# EAGLE design v1 (EAGLE 8.5.1)
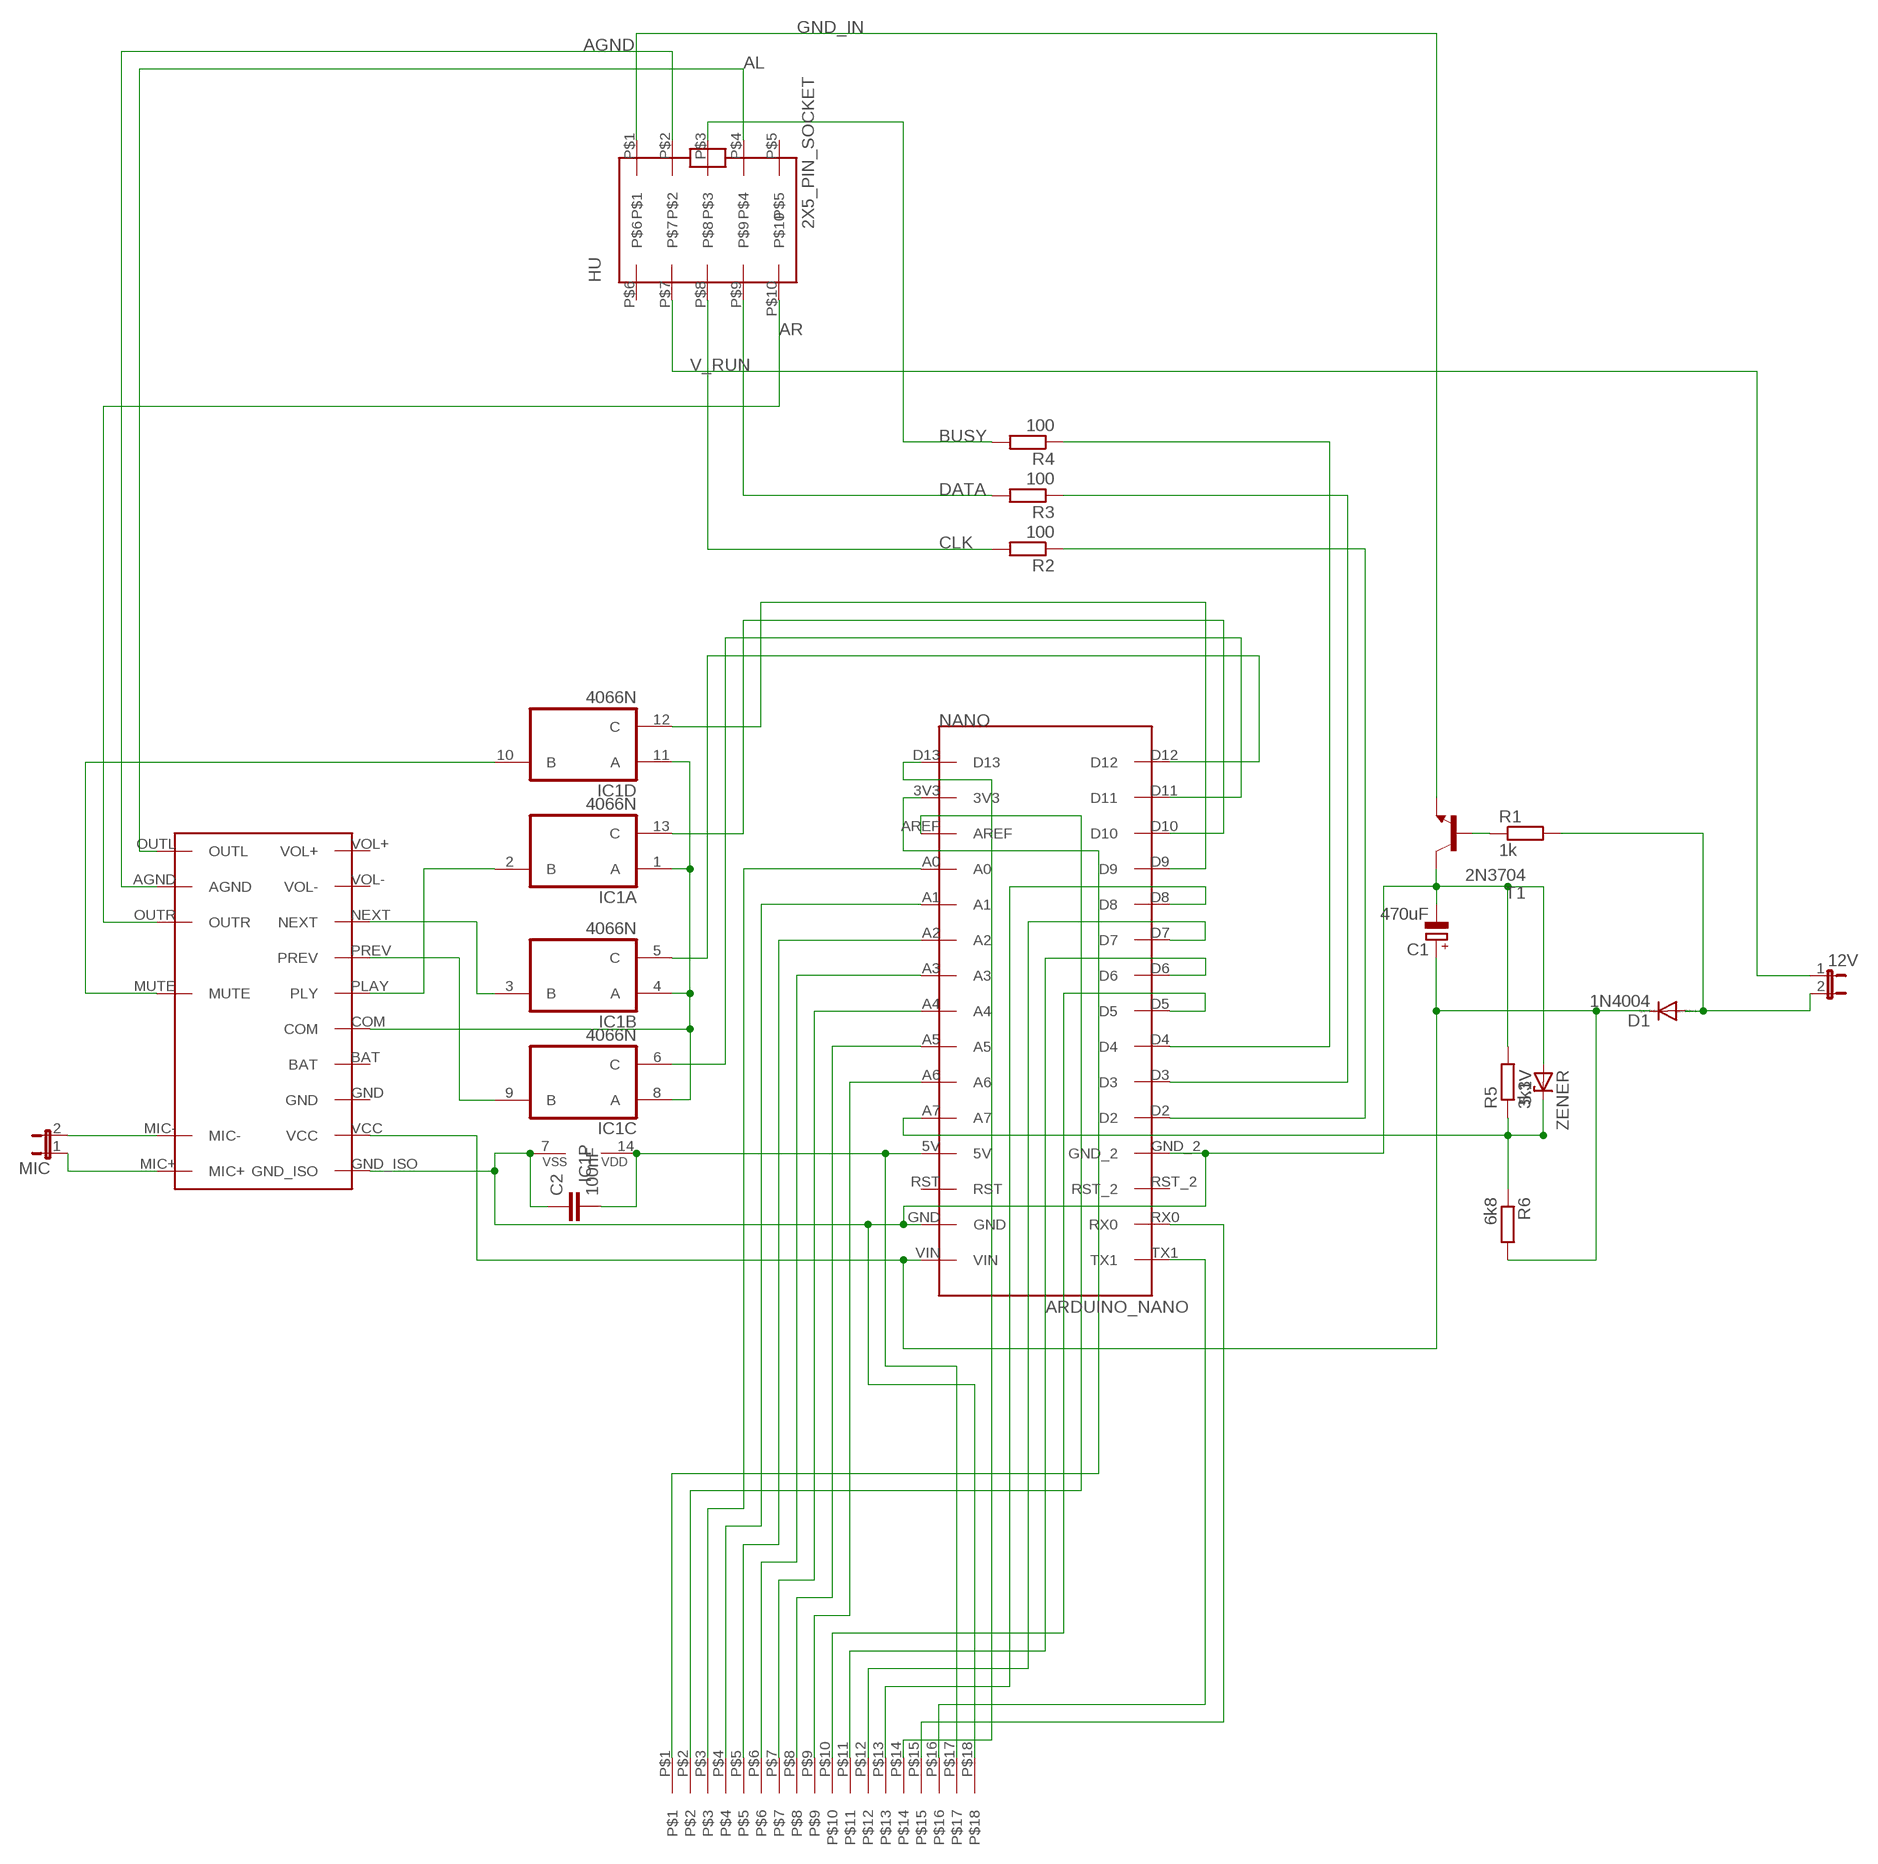
[diagram p0: schematic, sheet 1]

## Parts
12V  JP1E  [JP1]
C1  470uF  CPOL-EUE3.5-8  [E3,5-8]
C2  100nF  C-EUC1206  [C1206]
D1  1N4004  [DO41-10]
HU  2X5_PIN_SOCKET  [2X5_PIN_SOCKET]
IC1  4066N  [DIL14]
MIC  JP1E  [JP1]
NANO  ARDUINO_NANO  [ARDUINO_NANO]
R1  1k  R-EU_0207/10  [0207/10]
R2  100  R-EU_0207/10  [0207/10]
R3  100  R-EU_0207/10  [0207/10]
R4  100  R-EU_0207/10  [0207/10]
R5  3k3  R-EU_0207/10  [0207/10]
R6  6k8  R-EU_0207/10  [0207/10]
T1  2N3704  [TO92]
U$1  JMP18X1  [JMP18X1]
U$2  CSR8645_MODULE  [CSR8645_MODULE]
ZENER  5.1V  ZENER-DIODEDO41Z10  [DO41Z10]

## Nets
12V: 12V.2 D1.A R1.2
AGND: HU.P$2 U$2.AGND
AL: HU.P$4 U$2.OUTL
AR: HU.P$10 U$2.OUTR
BUSY: HU.P$3 R4.2
CLK: HU.P$8 R2.2
DATA: HU.P$9 R3.2
GND: C1.- C2.1 IC1.7(P:VSS) NANO.GND NANO.GND_2 R5.2 T1.2(C) U$1.P$18 U$2.GND_ISO ZENER.A
GND_IN: HU.P$1 T1.3(E)
N$1: IC1.5(B:C) NANO.D12
N$2: IC1.6(C:C) NANO.D11
N$3: IC1.13(A:C) NANO.D10
N$4: IC1.12(D:C) NANO.D9
N$5: NANO.TX1 U$1.P$16
N$6: IC1.1(A:A) IC1.4(B:A) IC1.8(C:A) IC1.11(D:A) U$2.COM
N$7: R1.1 T1.1(B)
N$8: NANO.A7 R5.1 R6.1 ZENER.C
N$9: IC1.2(A:B) U$2.PLAY(PLY)
N$10: NANO.RX0 U$1.P$15
N$11: IC1.9(C:B) U$2.PREV
N$12: IC1.3(B:B) U$2.NEXT
N$13: NANO.D2 R2.1
N$14: C2.2 IC1.14(P:VDD) NANO.5V U$1.P$17
N$15: IC1.10(D:B) U$2.MUTE
N$16: NANO.D3 R3.1
N$17: NANO.D4 R4.1
N$18: NANO.D13 U$1.P$14
N$19: NANO.D8 U$1.P$13
N$20: NANO.D7 U$1.P$12
N$21: NANO.D6 U$1.P$11
N$22: NANO.D5 U$1.P$10
N$23: NANO.A6 U$1.P$9
N$24: NANO.A5 U$1.P$8
N$25: NANO.A4 U$1.P$7
N$26: NANO.A3 U$1.P$6
N$27: NANO.A2 U$1.P$5
N$28: NANO.A1 U$1.P$4
N$29: NANO.A0 U$1.P$3
N$30: NANO.AREF U$1.P$2
N$31: NANO.3V3 U$1.P$1
N$32: MIC.1 U$2.MIC+
N$33: MIC.2 U$2.MIC-
V_RUN: 12V.1 HU.P$7
VCC: C1.+ D1.C NANO.VIN R6.2 U$2.VCC
Unconnected: HU.P$5 HU.P$6 NANO.RST NANO.RST_2 U$2.BAT U$2.GND U$2.VOL+ U$2.VOL-

## Library data of the parts
12V MIC = jumper:JP1E: JUMPER
C1 = rcl:CPOL-EU: POLARIZED CAPACITOR, European symbol; SPICEPREFIX: C
C2 = rcl:C-EU: CAPACITOR, European symbol; SPICEPREFIX: C
D1 = diode:1N4004: DIODE general purpose rectifier, 1 A
HU = archi_laptop:2X5_PIN_SOCKET
IC1 = 40xx:4066: Quad bilateral ANALOG SWITCH
NANO = archi_laptop:ARDUINO_NANO
R1-R6 = rcl:R-EU_: RESISTOR, European symbol; SPICEPREFIX: R
T1 = transistor:2N3704: NPN TRANSISTOR
U$1 = archi_laptop:JMP18X1
U$2 = archi_laptop:CSR8645_MODULE
ZENER = diode:ZENER-DIODE: Z-Diode

## Board
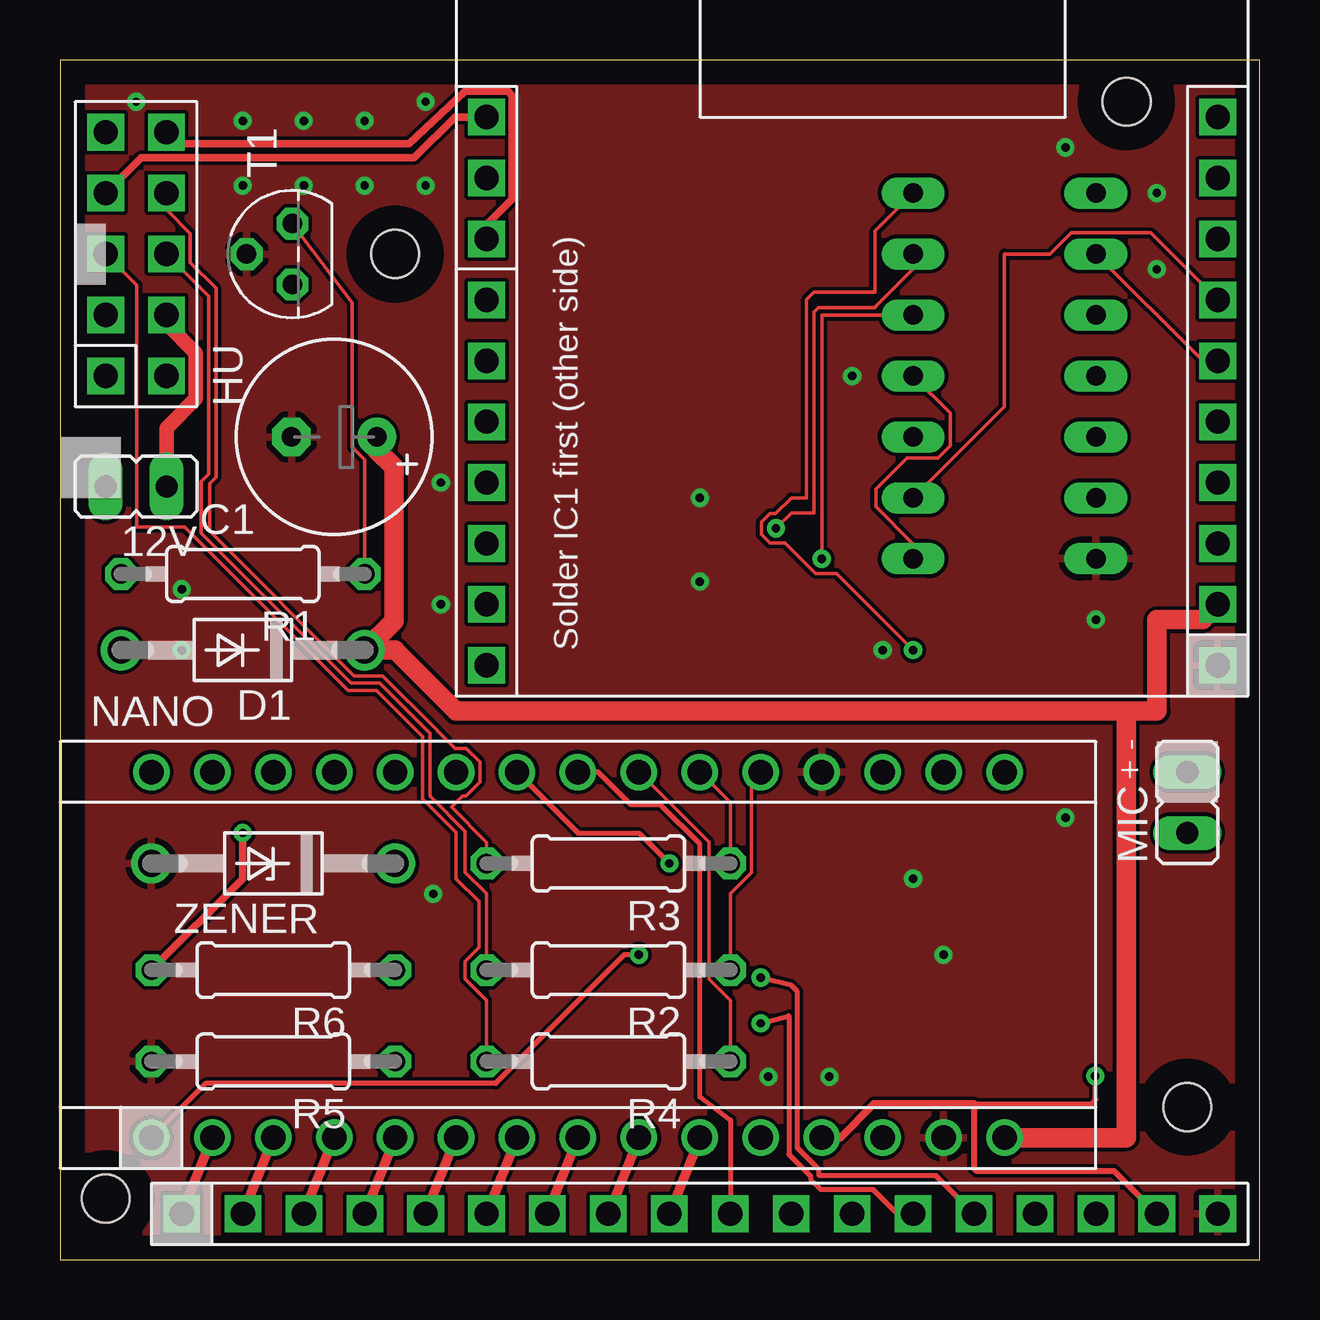
[diagram p1: board, top side]
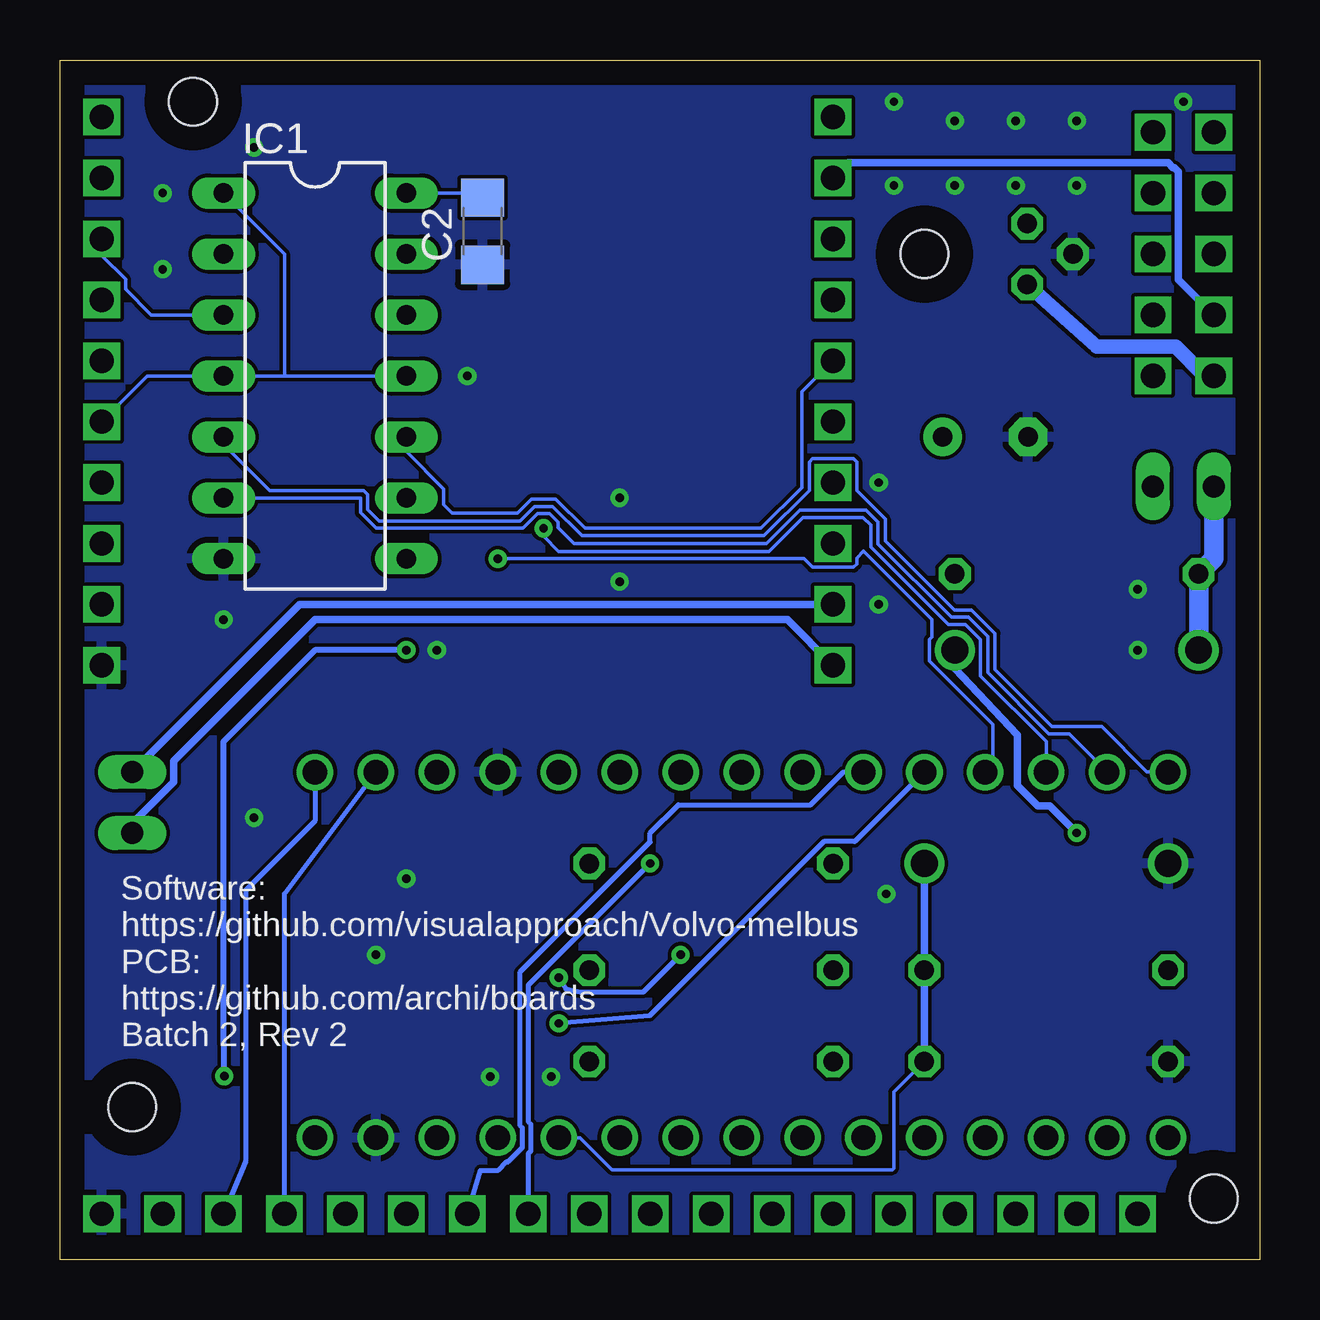
[diagram p2: board, bottom side, seen from below]

Size 50 x 50 mm. Coordinates in mm from the lower left corner, seen from the top.
Outline: 0,0 50,0 50,50 0,50 0,0
Copper layers (1*16): Top 0.035mm / dielectric 1.5mm / Bottom 0.035mm
Design rules "default *": minimum track width 6mil, minimum drill 0.35mm, track to track 6mil, track to pad 6mil, pad to pad 6mil, via to via 6mil, smd to smd 6mil, copper to edge 40mil, drill to drill 6mil, minimum pad ring 10mil, minimum via ring 8mil, stop-mask expansion 4mil, vias tented up to drill 0mil, thermal gap 10mil
Holes 2 mm at 13.97,41.91 46.99,6.35 44.45,48.26 1.91,2.54

### Footprints (pad centres in the part's own frame; a part is rotated, then mirrored left to right if it is on the bottom)
JP1 = drill 0.914 long: 1 0,-1.27; 2 0,1.27
E3,5-8 = drill 0.813 pad 1.6: + -1.778,0 | drill 0.813 pad 1.6 octagon: - 1.778,0
C1206 = smd 1.6 x 1.8: 1 -1.4,0; 2 1.4,0
DO41-10 = drill 1.118: A 5.08,0; C -5.08,0
2X5_PIN_SOCKET = drill 1.016 square: P$1 -5.08,2.54; P$2 -2.54,2.54; P$3 0,2.54; P$4 2.54,2.54; P$5 5.08,2.54; P$6 -5.08,0; P$7 -2.54,0; P$8 0,0; P$9 2.54,0; P$10 5.08,0
DIL14 = drill 0.813 long: 1 -7.62,-3.81; 2 -5.08,-3.81; 3 -2.54,-3.81; 4 0,-3.81; 5 2.54,-3.81; 6 5.08,-3.81; 7 7.62,-3.81; 8 7.62,3.81; 9 5.08,3.81; 10 2.54,3.81; 11 0,3.81; 12 -2.54,3.81; 13 -5.08,3.81; 14 -7.62,3.81
ARDUINO_NANO = drill 1.016: 3V3 -7.62,12.7; 5V -7.62,-12.7; A0 -7.62,7.62; A1 -7.62,5.08; A2 -7.62,2.54; A3 -7.62,0; A4 -7.62,-2.54; A5 -7.62,-5.08; A6 -7.62,-7.62; A7 -7.62,-10.16; AREF -7.62,10.16; D2 7.62,-10.16; D3 7.62,-7.62; D4 7.62,-5.08; D5 7.62,-2.54; D6 7.62,0; D7 7.62,2.54; D8 7.62,5.08; D9 7.62,7.62; D10 7.62,10.16; D11 7.62,12.7; D12 7.62,15.24; D13 -7.62,15.24; GND -7.62,-17.78; GND_2 7.62,-12.7; RST -7.62,-15.24; RST_2 7.62,-15.24; RX0 7.62,-17.78; TX1 7.62,-20.32; VIN -7.62,-20.32
0207/10 = drill 0.813 octagon: 1 -5.08,0; 2 5.08,0
TO92 = drill 0.813 octagon: 1 1.27,0; 2 0,1.905; 3 -1.27,0
JMP18X1 = drill 1.016 square: P$1 0,12.7; P$2 0,10.16; P$3 0,7.62; P$4 0,5.08; P$5 0,2.54; P$6 0,0; P$7 0,-2.54; P$8 0,-5.08; P$9 0,-7.62; P$10 0,-10.16; P$11 0,-12.7; P$12 0,-15.24; P$13 0,-17.78; P$14 0,-20.32; P$15 0,-22.86; P$16 0,-25.4; P$17 0,-27.94; P$18 0,-30.48
CSR8645_MODULE = drill 1.016 square: AGND -15.24,5.08; BAT 15.24,-7.62; COM 15.24,-5.08; GND 15.24,-10.16; GND_ISO 15.24,-15.24; MIC+ -15.24,-15.24; MIC- -15.24,-12.7; MUTE -15.24,-2.54; NEXT 15.24,2.54; OUTL -15.24,7.62; OUTR -15.24,2.54; P$1 -15.24,0; P$2 -15.24,-5.08; P$3 -15.24,-7.62; P$4 -15.24,-10.16; PLAY 15.24,-2.54; PREV 15.24,0; VCC 15.24,-12.7; VOL+ 15.24,7.62; VOL- 15.24,5.08
DO41Z10 = drill 1.118: A 5.08,0; C -5.08,0

### Placement (x,y rotation side)
12V  3.17,32.23 90 top
C1  11.43,34.29 180 top
C2  32.38,42.86 90 bottom
D1  7.62,25.4 180 top
HU  4.45,41.91 90 top
IC1  39.37,36.83 270 bottom
MIC  46.99,19.05 0 top
NANO  19.05,12.7 90 top
R1  7.62,28.57 180 top
R2  22.86,12.06 180 top
R3  22.86,16.51 180 top
R4  22.86,8.26 180 top
R5  8.89,8.26 180 top
R6  8.89,12.06 180 top
T1  9.68,41.91 90 top
U$1  17.78,1.91 90 top
U$2  33.02,40.01 0 top
ZENER  8.89,16.51 180 top

### Tracks (layer width: path | path; a pad name or v marks a point on that pad's centre or on a via)
12V
  Bottom 0.813: 12V.2 1.91,29.21 R1.2 D1.A
AGND
  Bottom 0.305: HU.P$2 3.38,40.84 3.38,45.34 3.56,45.52 3.61,45.52 3.81,45.72 17.14,45.72 U$2.AGND
AL
  Top 0.305: U$2.OUTL 16.47,47.62 14.77,45.92 3.38,45.92 HU.P$4
AR
  Top 0.305: U$2.OUTR 17.78,43.13 18.85,44.2 18.85,48.51 18.67,48.69 16.89,48.69 14.55,46.51 4.92,46.51 HU.P$10
BUSY
  Top 0.152: R4.2 17.78,10.81 16.89,11.7 16.89,12.43 17.46,13.01 17.46,14.92 16.51,15.88 16.51,17.8 15.12,19.19 15.12,21.8 13.2,23.72 12.01,23.72 5.21,30.52 3.2,30.52 3.2,40.62 HU.P$3
CLK
  Top 0.152: R2.2 17.78,15.25 16.89,16.14 16.89,17.85 15.42,19.32 15.42,21.93 13.32,24.03 12.7,24.03 12.13,24.03 5.89,30.27 5.89,32.42 6.2,32.73 6.2,33.02 6.2,40.16 HU.P$8
DATA
  Top 0.152: R3.2 17.78,17.39 16.32,18.86 16.79,19.33 16.92,19.33 17.5,19.91 17.5,20.73 16.92,21.31 16.47,21.31 15.73,22.05 15.72,22.07 13.45,24.33 12.26,24.33 6.23,30.36 | 6.23,30.36 6.19,30.4 | 6.23,30.36 6.23,32.33 6.5,32.61 6.5,40.49 5.44,41.55 5.44,42.77 4.45,43.76 HU.P$9
GND  (via drill 0.35)
  other vias: 7.62,47.47 10.16,47.47 7.62,44.77 10.16,44.77 12.7,44.77 15.24,44.77 12.7,47.47 15.24,48.26 3.17,48.26 15.88,27.3 29.53,7.62 15.56,15.24 32.07,7.62 41.91,46.35 45.72,44.45 41.91,18.41 45.72,41.27 36.83,12.7 35.56,15.88 26.67,28.26 15.88,32.38 33.02,36.83 34.29,25.4 26.67,31.75 43.18,26.67 5.08,25.4 5.08,27.94
  pour Bottom: -2.54,53.34 53.34,52.07 53.34,-15.24 -2.54,-15.24
  pour Top: -2.54,52.7 54.61,52.7 54.61,-2.54 53.34,-3.81 -5.08,-2.54
GND_IN
  Bottom 0.61: HU.P$1 2.27,36.83 3.49,38.05 6.78,38.05 T1.3
N$1
  Bottom 0.152: IC1.5 43.18,33.97 41.26,32.05 37.35,32.05 37.17,31.88 37.17,31.25 36.7,30.79 30.83,30.79 30.22,31.39 29.47,31.39 28.25,30.17 20.65,30.17 18.77,32.05 18.77,33.24 18.64,33.38 16.92,33.38 16.79,33.24 16.79,32.05 15.6,30.86 15.6,29.95 12.72,27.08 12.01,27.08 11.02,26.09 11.02,24.59 8.65,22.21 6.58,22.21 4.69,20.32 NANO.D12
N$2
  Bottom 0.152: IC1.6 37.48,31.75 37.48,31.13 36.83,30.48 30.7,30.48 30.1,31.09 29.59,31.09 29.24,30.73 29.24,30.51 28.57,29.84 20.55,29.84 19.16,31.24 16.41,31.24 15.9,30.73 15.9,29.83 12.84,26.77 12.13,26.77 11.33,25.97 11.33,24.46 8.78,21.91 7.94,21.91 NANO.D11
N$3  (via drill 0.35)
  Top 0.152: v29.84,30.48 30.48,31.11 31.43,31.11 31.43,39.48 31.62,39.67 33.96,39.67 34.01,39.73 34.01,39.74 35.56,41.29 IC1.13
  Bottom 0.152: v29.84,30.48 29.84,30.15 29.21,29.52 20.45,29.52 19.03,30.93 16.53,30.93 16.2,30.61 16.2,29.7 12.97,26.47 12.26,26.47 11.63,25.84 11.63,24.33 8.89,21.59 NANO.D10
N$4  (via drill 0.35)
  Top 0.152: v31.75,29.21 31.75,39.37 IC1.12
  Bottom 0.152: NANO.D9 11.11,20.64 11.11,22.3 13.77,24.96 13.77,25.84 13.65,25.96 13.65,26.67 16.51,29.53 16.79,29.25 16.79,28.99 16.92,28.85 18.64,28.85 18.99,29.21 v31.75,29.21
N$5
  Bottom 0.203: NANO.TX1 39.37,18.28 42.27,15.39 42.27,4.09 U$1.P$16
N$6
  Top 0.152: IC1.8 35.56,29.83 34.01,31.38 34.01,32.12 35.29,33.4 36.59,33.4 37.11,33.92 37.11,35.28 IC1.11
  Bottom 0.152: IC1.11 40.64,36.83 | 40.64,36.83 IC1.4 46.35,36.83 U$2.COM | IC1.1 40.64,41.91 40.64,36.83
N$7
  Top 0.152: R1.1 12.7,33.34 12.18,33.86 12.18,39.89 T1.1
N$8
  Bottom 0.152: R5.1 15.24,6.99 15.24,3.81 15.31,3.74 26.99,3.74 28.33,5.08 NANO.A7
  Bottom 0.305: ZENER.C R6.1 R5.1
N$9
  Top 0.152: IC1.2 47.62,37.47 U$2.PLAY
N$10
  Bottom 0.203: U$1.P$15 40.64,15.24 NANO.RX0
N$11
  Top 0.152: IC1.9 39.37,35.56 39.37,41.91 41.26,41.91 42.15,42.8 45.47,42.8 U$2.PREV
N$12
  Bottom 0.152: IC1.3 46.19,39.37 47.27,40.45 47.27,40.86 48.26,41.85 U$2.NEXT
N$13
  Top 0.152: R2.1 27.94,15.25 28.83,16.14 28.83,19.94 NANO.D2
N$14  (via drill 0.35)
  Top 0.152: v35.56,25.4 32.36,28.6 31.5,28.6 30.23,29.87 29.59,29.87 29.24,30.23 29.24,30.73 29.59,31.09 29.82,31.09 30.48,31.75 31.11,31.75 31.11,40.01 31.43,40.32 33.97,40.32 33.97,42.86 IC1.14
  Top 0.203: 38.1,6.49 43.01,6.49 43.18,6.67 43.15,6.7 v43.15,7.65
  Top 0.254: U$1.P$17 43.93,3.69 38.22,3.69 38.1,3.81 38.1,6.49
  Top 0.305: NANO.5V 32.52,5.08 33.93,6.49 38.1,6.49
  Bottom 0.152: IC1.14 32.57,44.45 C2.2
  Bottom 0.254: v43.15,7.65 43.18,10.21 43.18,21.59 39.37,25.4 v35.56,25.4
N$15
  Bottom 0.152: IC1.10 35.56,33.67 34.01,32.12 34.01,31.47 33.66,31.11 30.93,31.11 30.35,31.7 29.34,31.7 28.12,30.48 20.77,30.48 19.07,32.18 19.07,36.17 U$2.MUTE
N$16
  Top 0.152: R3.1 27.94,19.05 NANO.D3
N$17
  Top 0.152: R4.1 27.94,10.81 27.05,11.7 27.05,17.4 NANO.D4
N$18  (via drill 0.35)
  Top 0.203: v24.13,12.7 23.52,12.7 18.16,7.34 6.07,7.34 NANO.D13 | U$1.P$14 36.51,3.49 31.64,3.49 31.64,3.75 30.73,4.66 30.73,11.18 30.48,11.43 v29.21,11.75
  Bottom 0.203: v29.21,11.75 28.92,11.27 28.32,11.15 25.68,11.15 v24.13,12.7
N$19  (via drill 0.35)
  Top 0.203: v29.21,9.84 30.38,10.16 30.38,4.39 31.29,3.48 31.29,3.35 31.71,2.92 33.89,2.92 34.9,1.91 U$1.P$13
  Bottom 0.203: NANO.D8 16.87,17.42 18.16,17.42 25.42,10.16 v29.21,9.84
N$20
  Bottom 0.203: U$1.P$12 32.48,3.72 31.75,3.72 31.4,4.06 31.33,4.06 30.73,4.66 30.73,5.5 30.84,5.6 30.84,11.97 25.4,17.4 25.4,17.78 24.22,18.96 18.71,18.96 17.35,20.32 NANO.D7
N$21  (via drill 0.35)
  Top 0.203: NANO.D6 21.59,17.78 24.13,17.78 v25.4,16.51
  Bottom 0.203: v25.4,16.51 30.48,11.43 30.48,5.75 30.38,5.65 30.38,4.51 30.48,4.41 U$1.P$11
N$22
  Top 0.203: NANO.D5 22.43,20.32 23.8,18.96 25.02,18.96 26.67,17.31 26.67,6.78 27.95,5.81 27.95,1.92 U$1.P$10
N$23
  Top 0.406: NANO.A6 U$1.P$9
N$24
  Top 0.406: NANO.A5 U$1.P$8
N$25
  Top 0.406: U$1.P$7 NANO.A4
N$26
  Top 0.406: NANO.A3 U$1.P$6
N$27
  Top 0.406: U$1.P$5 NANO.A2
N$28
  Top 0.406: NANO.A1 U$1.P$4
N$29
  Top 0.406: U$1.P$3 NANO.A0
N$30
  Top 0.406: NANO.AREF U$1.P$2
N$31
  Top 0.406: U$1.P$1 NANO.3V3
N$32
  Bottom 0.305: U$2.MIC+ 19.68,26.67 39.37,26.67 45.26,20.78 45.26,19.9 46.99,18.17 MIC.1
N$33
  Bottom 0.305: U$2.MIC- 40.01,27.3 MIC.2
V_RUN
  Top 0.61: 12V.1 4.45,34.66 5.66,35.88 5.66,37.78 4.45,39 HU.P$7
VCC  (via drill 0.35)
  Top 0.305: R6.2 7.62,15.88 v7.62,17.78
  Top 0.813: C1.+ 13.21,33.73 13.92,33.02 13.92,26.62 D1.C 13.97,25.4 16.51,22.86 44.45,22.86 | 44.45,22.86 45.72,22.86 45.72,26.67 47.62,26.67 U$2.VCC | NANO.VIN 44.45,5.08 44.45,22.86
  Bottom 0.305: v7.62,17.78 8.75,18.91 9.25,18.91 10.1,19.76 10.1,21.86 12.7,24.63 D1.C

### Text on the board
tNames: Solder IC1 first (other side) | + -
bNames: Software: / https://github.com/visualapproach/Volvo-melbus / PCB: / https://github.com/archi/boards / Batch 2, Rev 2